# Altium project PCB_Project.PrjPcb
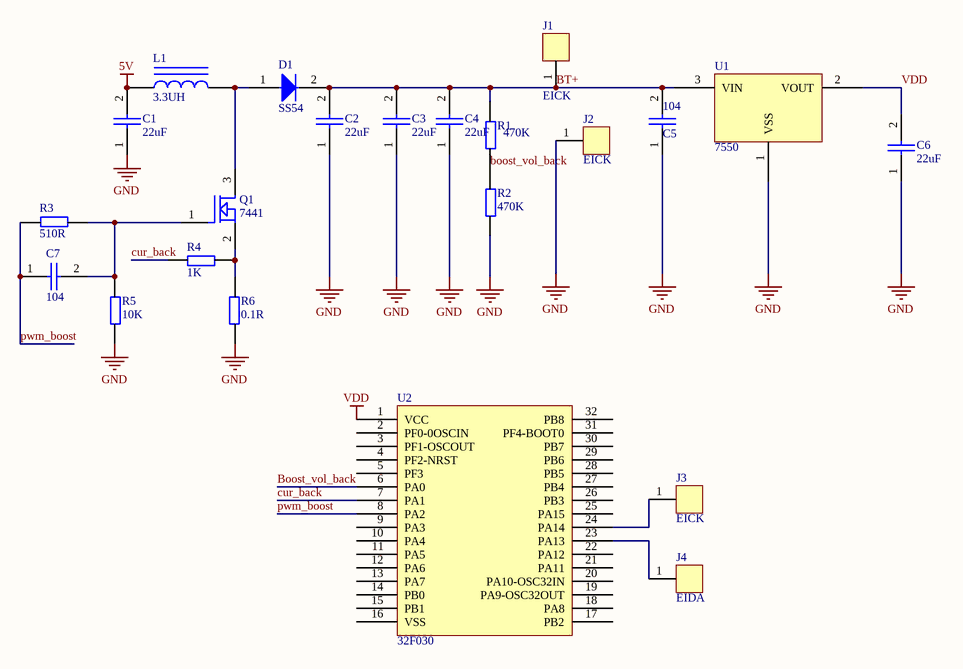
[diagram p0: Boost-V1.0.SchDoc]
2 sheets, 60 parts. Net scope: global (net labels, ports and power ports of the same name join across sheets).
Sheets:
  Boost-V1.0.SchDoc
  Boost-V2.0.SchDoc

## Sheet Boost-V1.0.SchDoc
size A4

### Parts
(Parts that share a designator on the sheet are numbered #1, #2 ... from top to bottom, then left to right.)
C1  22uF  [0805]
C2  22uF  [0805]
C3  22uF  [0805]
C4  22uF  [0805]
C5  104  [0603]
C6  22uF  [0805]
C7  104  [0603]
D1  SS54
J1  EICK  [PAD]
J2  EICK  [PAD]
J3  EICK  [PAD]
J4  EIDA  [PAD]
L1  3.3UH
Q1  7441  [SOT-89]
R1  470K  [0603]
R2  470K  [0603]
R3  510R  [0603]
R4  1K  [0603]
R5#1  10K  [0603]
R6#1  0.1R  [0603]
U1  7550  [SOT-89]
U2  32F030  [QFN32-5*5]

### Nets
5V: C1.2 L1.1
GND: C1.1 C2.1 C3.1 C4.1 C5.1 C6.1 J2.1 R2.1 R5#1.1 R6#1.2 U1.1(VSS)
VDD: C6.2 U1.2(VOUT) U2.1(VCC)
boost_vol_back: R1.1 R2.2 U2.6(PA0)
BT+: C2.2 C3.2 C4.2 C5.2 D1.2 J1.1 R1.2 U1.3(VIN)
cur_back: R4.1 U2.7(PA1)
pwm_boost: C7.1 R3.2 U2.8(PA2)
NetC7_2: C7.2 Q1.1 R3.1 R5#1.2
NetD1_1: D1.1 L1.2 Q1.3
NetJ3_1: J3.1 U2.24(PA14)
NetJ4_1: J4.1 U2.23(PA13)
NetQ1_2: Q1.2 R4.2 R6#1.1

Not connected (* = marked no-connect by the designer): U2 2(PF0-0OSCIN) 3(PF1-OSCOUT) 4(PF2-NRST) 5(PF3) 9(PA3) 10(PA4) 11(PA5) 12(PA6) 13(PA7) 14(PB0) 15(PB1) 16(VSS) 17(PB2) 18(PA8) 19(PA9-OSC32OUT) 20(PA10-OSC32IN) 21(PA11) 22(PA12) 25(PA15) 26(PB3) 27(PB4) 28(PB5) 29(PB6) 30(PB7) 31(PF4-BOOT0) 32(PB8)

### Library data of the parts
C1-C7 = CAP
D1 = DIODE
J1-J4 = CON1
L1 = INDUCTOF
Q1 = MOSFET N
R1-R4 R5#1 R6#1 = RES
U1 = 3508

## Sheet Boost-V2.0.SchDoc
size A4
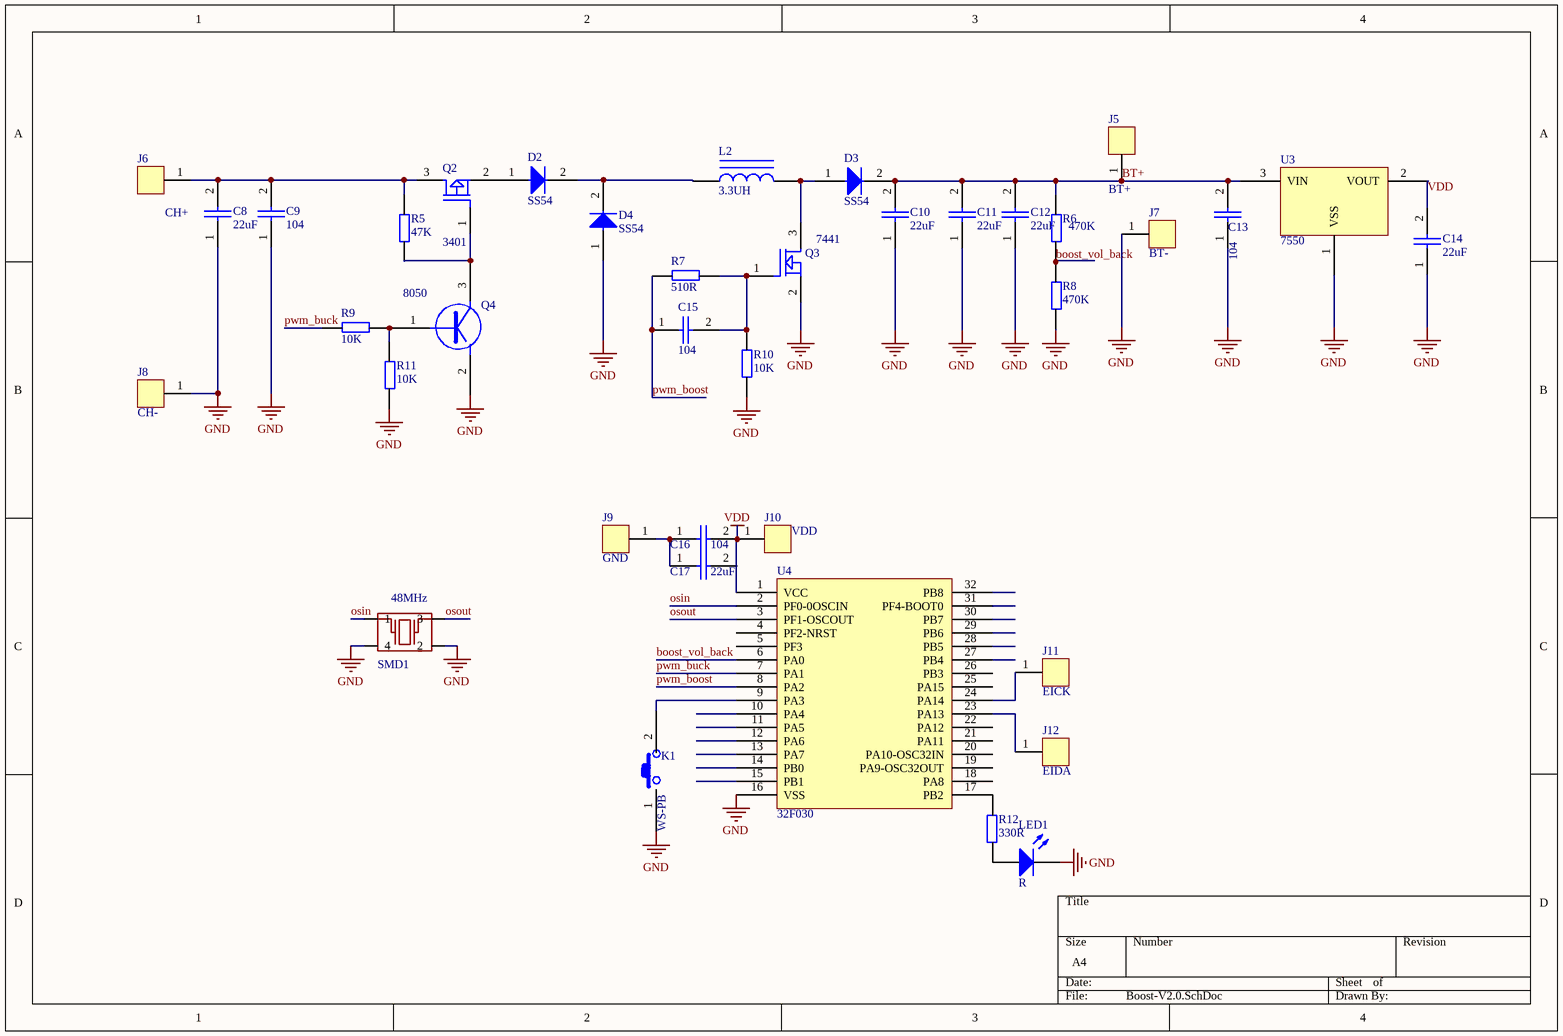
[diagram p1: Boost-V2.0.SchDoc]

### Parts
(Parts that share a designator on the sheet are numbered #1, #2 ... from top to bottom, then left to right.)
C8  22uF  [0805]
C9  104  [0805]
C10  22uF  [0805]
C11  22uF  [0805]
C12  22uF  [0805]
C13  104  [0603]
C14  22uF  [0805]
C15  104  [0603]
C16  104  [0603]
C17  22uF  [0603]
D2  SS54
D3  SS54
D4  SS54
J5  BT+  [PAD]
J6  CH+  [PAD]
J7  BT-  [PAD]
J8  CH-  [PAD]
J9  GND  [PAD]
J10  VDD  [PAD]
J11  EICK  [PAD]
J12  EIDA  [PAD]
K1  WS-PB  [SW-5517]
L2  3.3UH
LED1  R  [LED0603]
Q2  3401  [SOT-23]
Q3  7441  [SOT-89]
Q4  8050  [SOT-23]
R5#2  47K  [0603]
R6#2  470K  [0603]
R7  510R  [0603]
R8  470K  [0603]
R9  10K  [0603]
R10  10K  [0603]
R11  10K  [0603]
R12  330R  [0603]
SMD1  48MHz  [CR2016]
U3  7550  [SOT-89]
U4  32F030  [QFN32-5*5]

### Nets
GND: C8.1 C9.1 C10.1 C11.1 C12.1 C13.1 C14.1 D4.1 J7.1 J8.1 K1.1 LED1.2(K) Q3.2 Q4.2 R8.1 R10.1 R11.1 SMD1.2 SMD1.4 U3.1(VSS) U4.16(VSS)
VDD: C14.2 C16.2 J10.1 U3.2(VOUT) U4.1(VCC)
boost_vol_back: R6#2.1 R8.2 U4.6(PA0)
BT+: C10.2 C11.2 C12.2 C13.2 D3.2 J5.1 R6#2.2 U3.3(VIN)
osin: SMD1.1 U4.2(PF0-0OSCIN)
osout: SMD1.3 U4.3(PF1-OSCOUT)
pwm_boost: C15.1 R7.2 U4.8(PA2)
pwm_buck: R9.2 U4.7(PA1)
NetC8_2: C8.2 C9.2 J6.1 Q2.3 R5#2.2
NetC15_2: C15.2 Q3.1 R7.1 R10.2
NetC16_1: C16.1 C17.1 J9.1
NetD2_1: D2.1 Q2.2
NetD2_2: D2.2 D4.2 L2.1
NetD3_1: D3.1 L2.2 Q3.3
NetJ11_1: J11.1 U4.24(PA14)
NetJ12_1: J12.1 U4.23(PA13)
NetK1_2: K1.2 U4.9(PA3)
NetLED1_1: LED1.1(A) R12.2
NetQ2_1: Q2.1 Q4.3 R5#2.1
NetQ4_1: Q4.1 R9.1 R11.2
NetR12_1: R12.1 U4.17(PB2)

Not connected (* = marked no-connect by the designer): C17 2; U4 4(PF2-NRST) 5(PF3) 10(PA4) 11(PA5) 12(PA6) 13(PA7) 14(PB0) 15(PB1) 18(PA8) 19(PA9-OSC32OUT) 20(PA10-OSC32IN) 21(PA11) 22(PA12) 25(PA15) 26(PB3) 27(PB4) 28(PB5) 29(PB6) 30(PB7) 31(PF4-BOOT0) 32(PB8)

### Library data of the parts
C8-C17 = CAP
D2-D4 = DIODE
J5-J12 = CON1
L2 = INDUCTOF
LED1 = LED
Q2 = MOSFET P
Q3 = MOSFET N
Q4 = NPN
R5#2 R6#2 R7-R12 = RES
SMD1 = CRYSTAL4
U3 = 3508

## Nets that join several sheets
GND: Boost-V1.0 (11 pins), Boost-V2.0 (21 pins)
VDD: Boost-V1.0 (C6.2 U1.2 U2.1), Boost-V2.0 (5 pins)
boost_vol_back: Boost-V1.0 (R1.1 R2.2 U2.6), Boost-V2.0 (R6#2.1 R8.2 U4.6)
BT+: Boost-V1.0 (8 pins), Boost-V2.0 (8 pins)
pwm_boost: Boost-V1.0 (C7.1 R3.2 U2.8), Boost-V2.0 (C15.1 R7.2 U4.8)